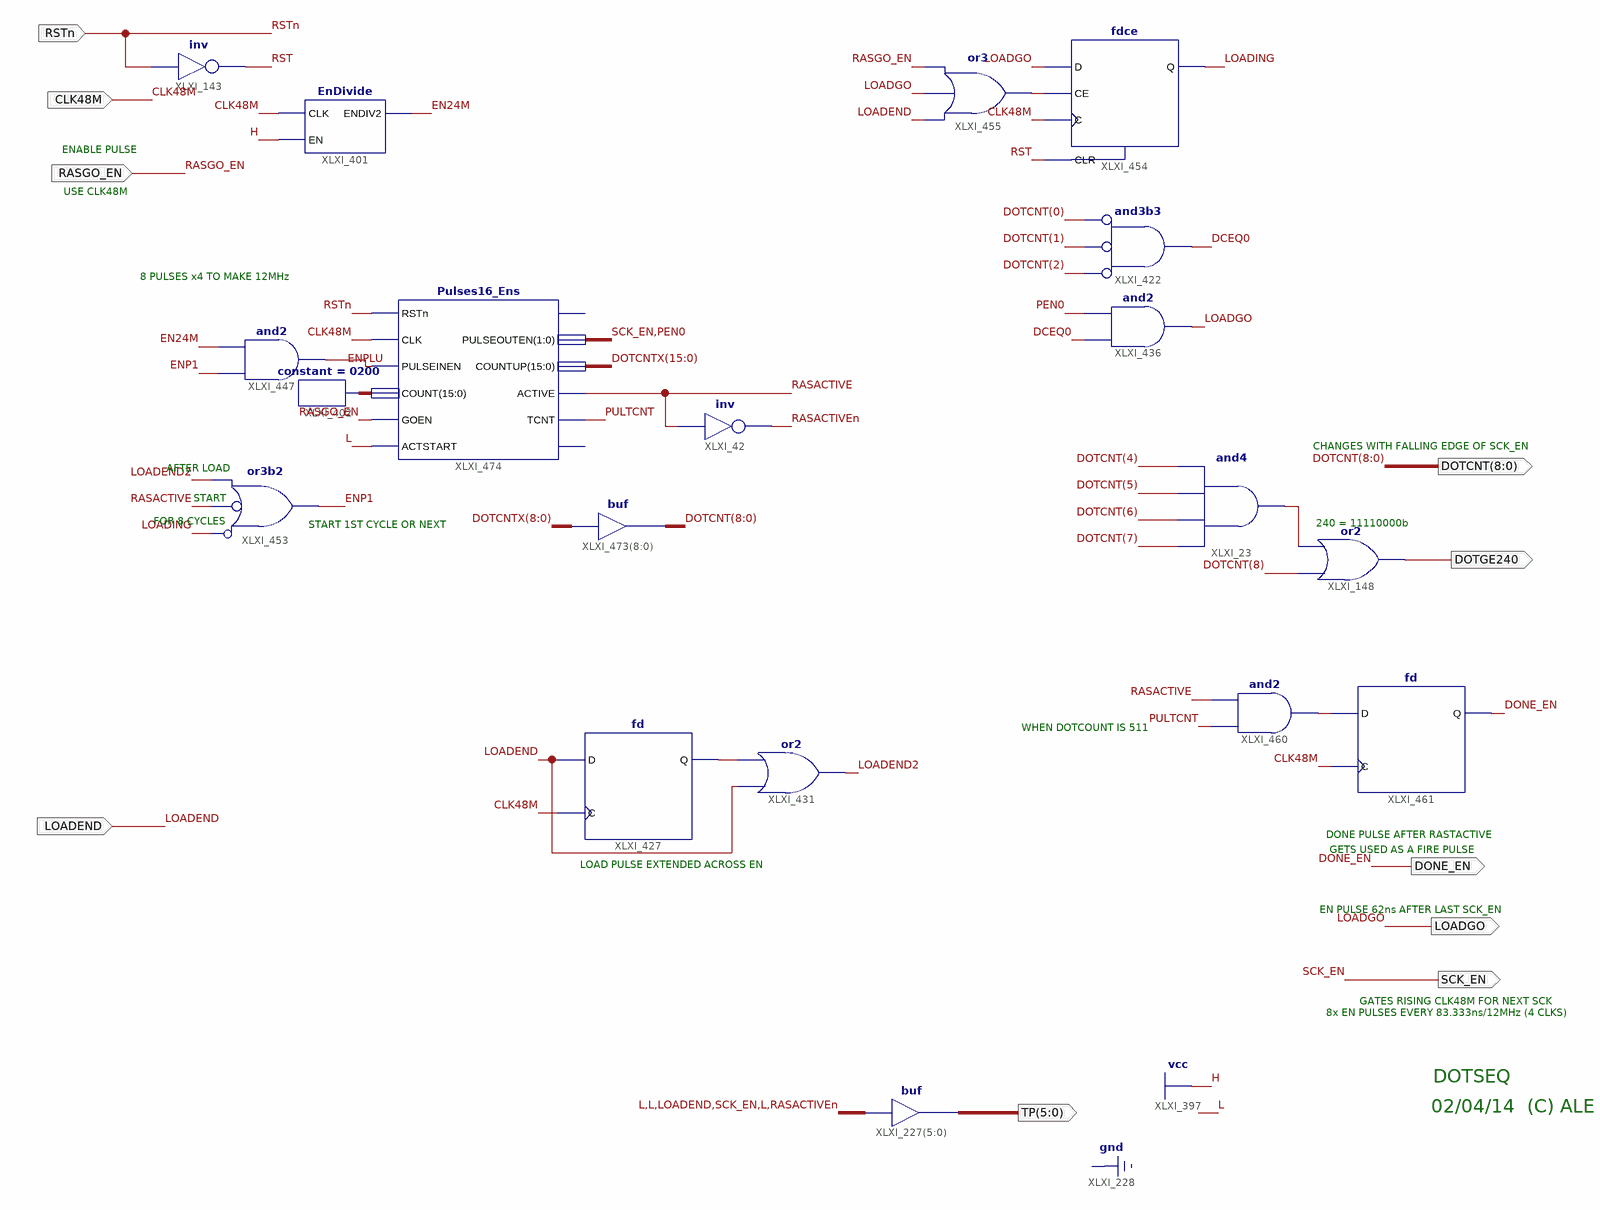
[diagram p0: schematic sheet 1]
// Xilinx ISE schematic DotSeq.sch (spartan3e) as structural Verilog: 19 symbols, 10 ports
module DotSeq (
  input  RSTn,
  input  CLK48M,
  input  RASGO_EN,
  input  LOADEND,
  output LOADGO,
  output [8:0] DOTCNT,
  output SCK_EN,
  output [5:0] TP,
  output DONE_EN,
  output DOTGE240
);

  wire DCEQ0, EN24M, ENP1, ENPLU, LOADEND2, LOADING, PEN0, PULTCNT, RASACTIVE, RASACTIVEn, RST, XLXN_130,
       XLXN_1008, XLXN_1085, XLXN_1099;
  wire [15:0] DOTCNTX, XLXN_983;

  not XLXI_143 (RST, RSTn);
  assign TP = {2'b00, LOADEND, SCK_EN, 1'b0, RASACTIVEn};  // buf XLXI_227[5..0], 6 bits wide
  or XLXI_455 (XLXN_1085, LOADEND, LOADGO, RASGO_EN);
  fdce XLXI_454 (.C(CLK48M), .CE(XLXN_1085), .CLR(RST), .D(LOADGO), .Q(LOADING));
  or XLXI_431 (LOADEND2, LOADEND, XLXN_1008);
  fd XLXI_427 (.C(CLK48M), .D(LOADEND), .Q(XLXN_1008));
  constant #(.CValue("0200")) XLXI_402 (.O(XLXN_983));
  and XLXI_447 (ENPLU, ENP1, EN24M);
  not XLXI_42 (RASACTIVEn, RASACTIVE);
  or XLXI_453 (ENP1, ~LOADING, ~RASACTIVE, LOADEND2);  // or3b2
  assign DOTCNT = DOTCNTX[8:0];  // buf XLXI_473[8..0], 9 bits wide
  EnDivide XLXI_401 (.CLK(CLK48M), .EN(1'b1), .ENDIV2(EN24M));
  and XLXI_422 (DCEQ0, ~DOTCNT[2], ~DOTCNT[1], ~DOTCNT[0]);  // and3b3
  and XLXI_436 (LOADGO, DCEQ0, PEN0);
  and XLXI_23 (XLXN_130, DOTCNT[7], DOTCNT[6], DOTCNT[5], DOTCNT[4]);
  or XLXI_148 (DOTGE240, DOTCNT[8], XLXN_130);
  and XLXI_460 (XLXN_1099, PULTCNT, RASACTIVE);
  fd XLXI_461 (.C(CLK48M), .D(XLXN_1099), .Q(DONE_EN));
  Pulses16_Ens XLXI_474 (
    .ACTIVE(RASACTIVE), .ACTSTART(1'b0), .CLK(CLK48M), .COUNT(XLXN_983), .COUNTUP(DOTCNTX), .GOEN(RASGO_EN),
    .PULSEINEN(ENPLU), .PULSEOUTEN({SCK_EN, PEN0}), .RSTn(RSTn), .TCNT(PULTCNT));  // open: DONEEN, PULSEOUT

  // Notes on the sheet:
  //   ENABLE PULSE
  //   USE CLK48M
  //   8 PULSES x4 TO MAKE 12MHz
  //   CHANGES WITH FALLING EDGE OF SCK_EN
  //   AFTER LOAD
  //   START
  //   FOR 8 CYCLES
  //   240 = 11110000b
  //   START 1ST CYCLE OR NEXT
  //   WHEN DOTCOUNT IS 511
  //   DONE PULSE AFTER RASTACTIVE
  //   GETS USED AS A FIRE PULSE
  //   LOAD PULSE EXTENDED ACROSS EN
  //   EN PULSE 62ns AFTER LAST SCK_EN
  //   GATES RISING CLK48M FOR NEXT SCK
  //   8x EN PULSES EVERY 83.333ns/12MHz (4 CLKS)
  //   DOTSEQ
  //   02/04/14  (C) ALE
endmodule
